# EasyEDA Pro project Servo_tester_Shematic.eprj

# Schematic Schematic1
Create Date: 2022-10-02; Page Name: P1; Project Name: Servo_tester_Shematic; Schematic Name: Schematic1; Update Date: 2024-05-20; Company: EasyEDA.com; Drawed: EasyEDA Pro; Page Size: A4; Part Number: JLCPCB-002; Reviewed: EasyEDA Pro; Version: V0.1
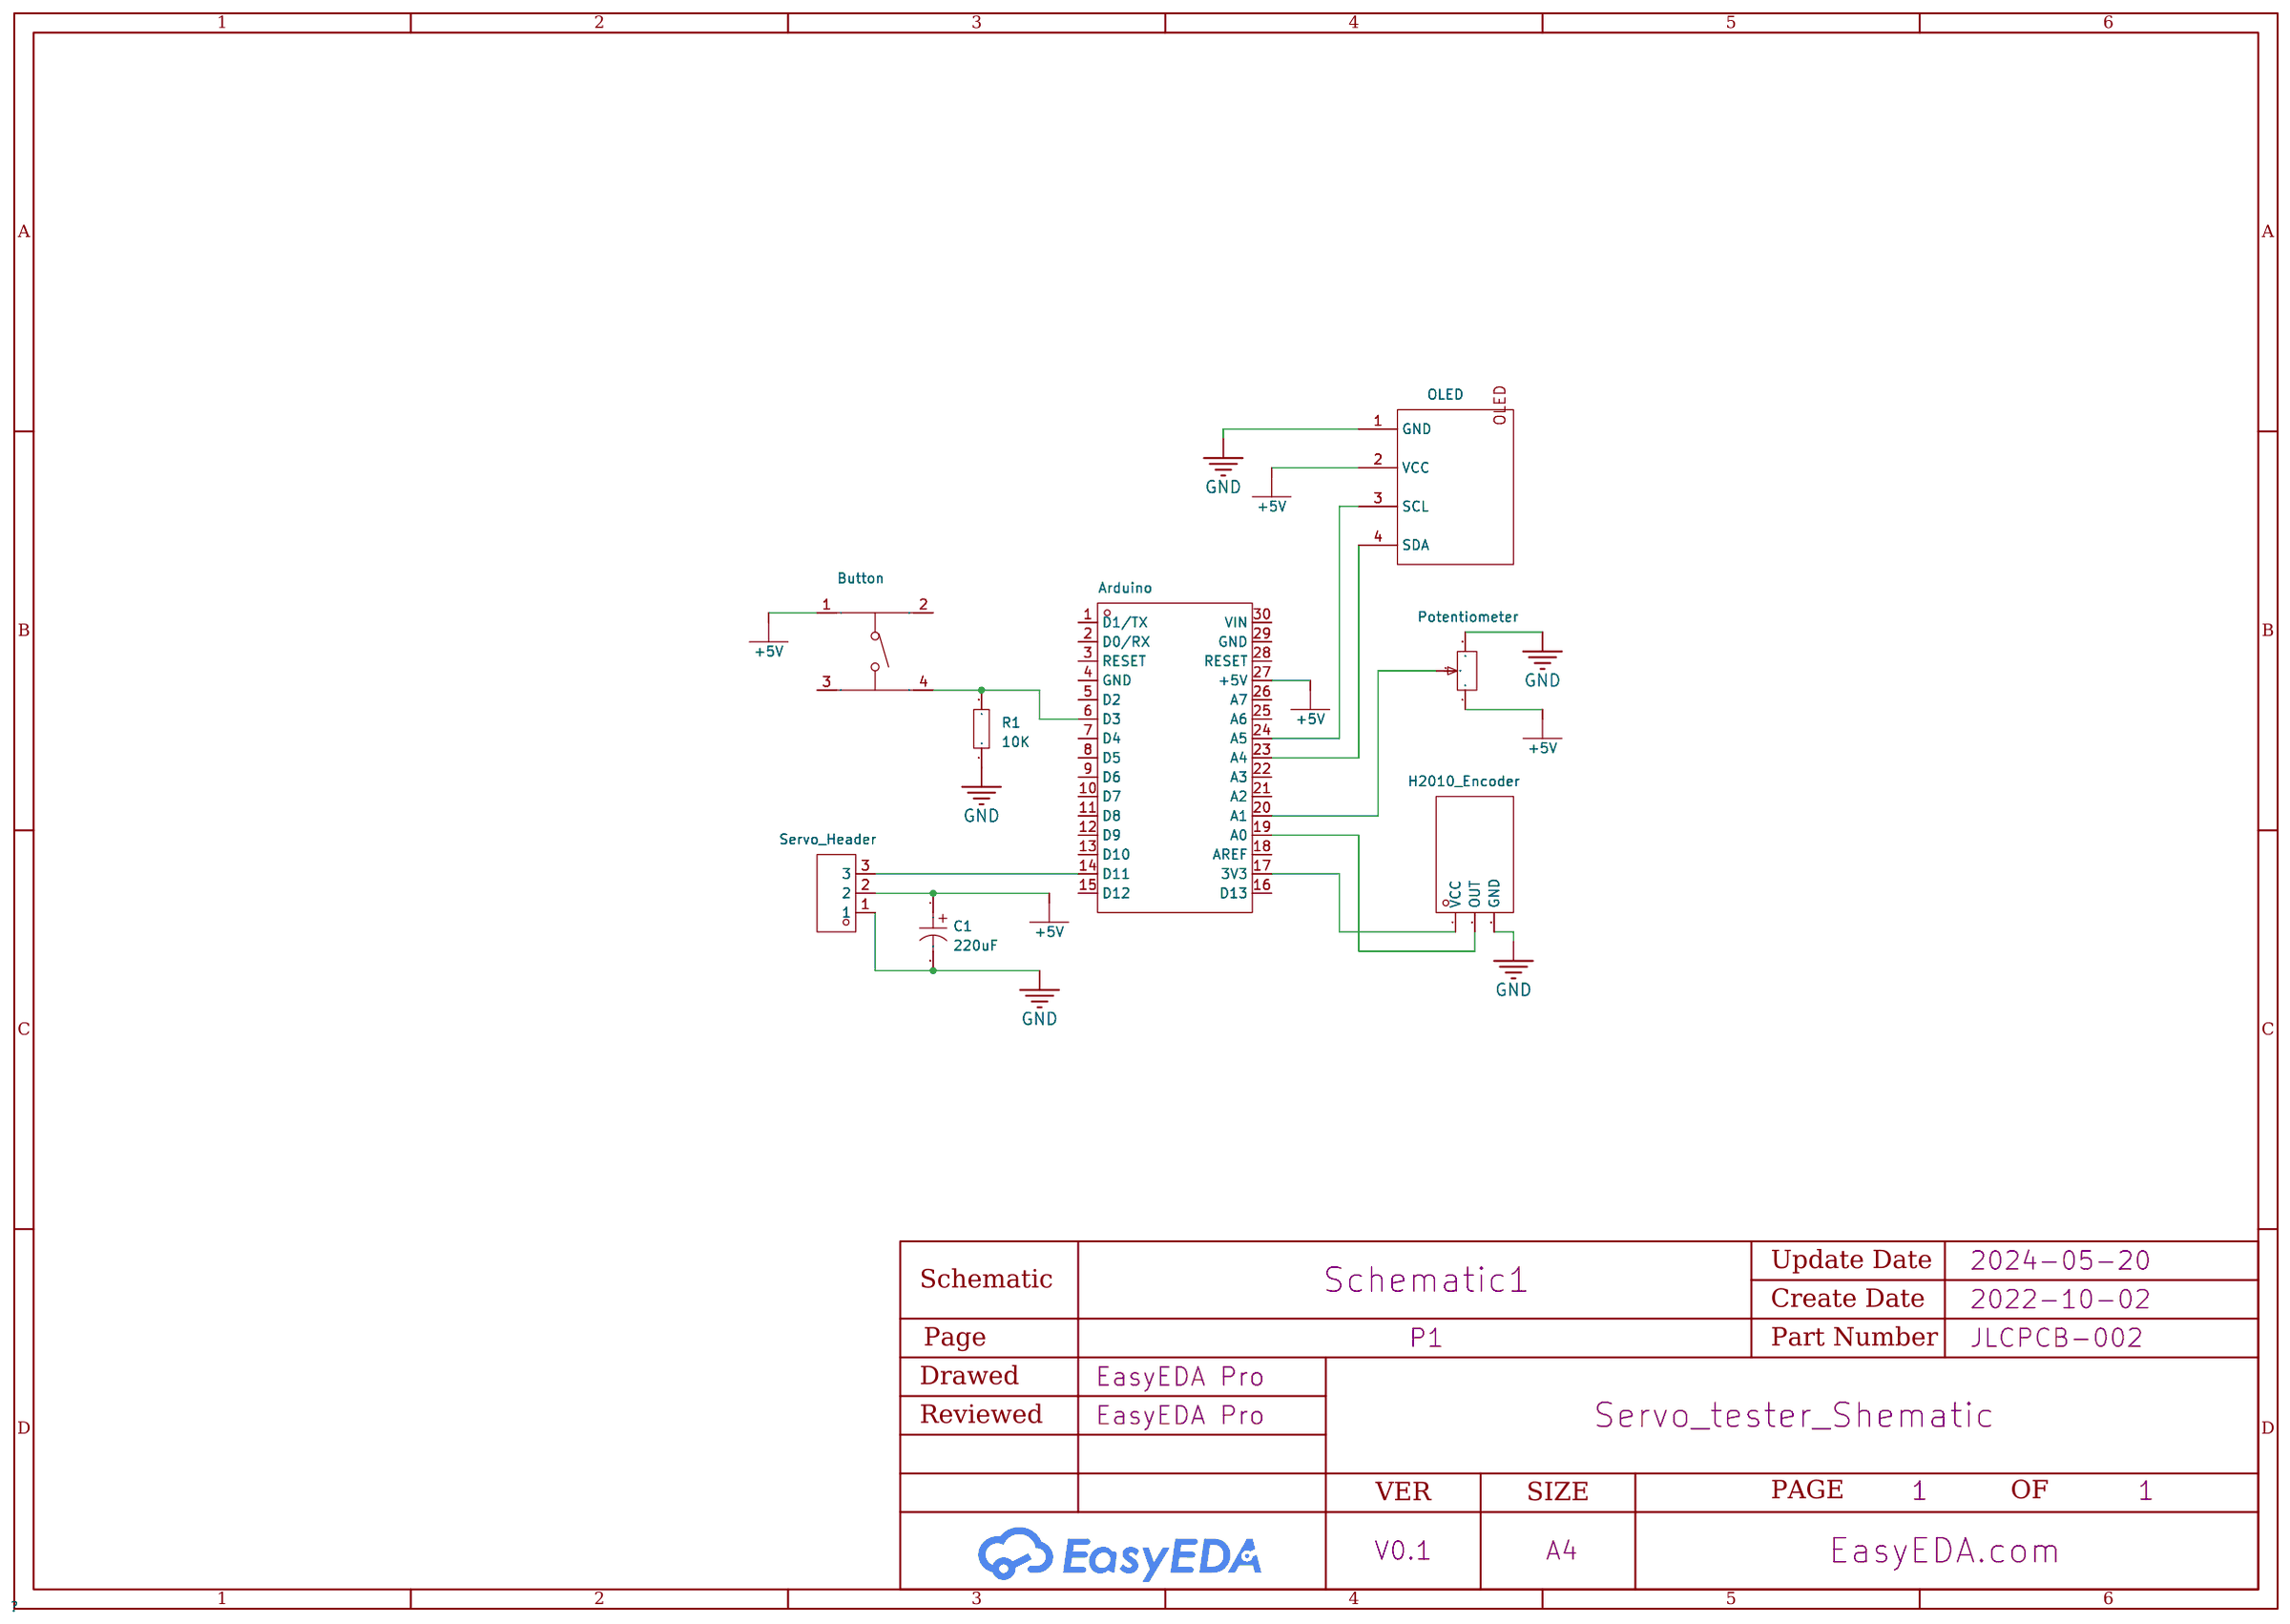
[diagram p0: schematic sheet]

## Parts
Arduino  -  [COMM-TH_ARDUINO_NANO]
C1  220uF  [CAP-TH_BD8.0-P3.50-D0.6-FD-2]
H1  Servo_Header  [HDR-TH_3P-P2.54-V-M]
H2010_Encoder  POWER3-1  [CONN-TH_XH2.54-3P]
KEY1  Button  [KEY-SMD_4P-L6.0-W6.0-P4.50-LS9.0]
OLED1  OLED  [0.96OLED_4P]
R1  10K  [RES-TH_BD2.5-L7.0-P11.00-D0.6-A]
U2  Potentiometer  [RES-ADJ-SMD_VG039NCH]

## Library data of the parts
Arduino = ARDUINO_NANO: Supplier Part: C9900017879; Supplier Footprint: THrough hole; JLCPCB Part Class: Extended Part; Datasheet: https://atta.szlcsc.comnull; Supplier: LCSC
C1 = KNH2220UF35V149EC0049: Capacitance: Tolerance:±20% Tolerance:±20% Rated Voltage: φD: L: Lead Spacing: Ripple Current:1.7A@100kHz Equivalent Series Resistance(ESR):40mΩ@100kHz Lifetime @ Temp:2000hrs@105 Operating Temperature:-55~+105 Operating Temperature:-55~+105; LCSC Part Name: 220uF ±20% 35V; Supplier Part: C2981462; Manufacturer: KNSCHA(科尼盛); Supplier Footprint: 径向引线,8x9mm; JLCPCB Part Class: Extended Part; Datasheet: https://atta.szlcsc.com/upload/public/pdf/source/20220426/9FC8A158D93B909CC105160B4A0CB698.pdf; Supplier: LCSC; Tolerance: ±20%; Ripple Current: 1.7A@100kHz; Equivalent Series Resistance(ESR): 40mΩ@100kHz; Lifetime @ Temp: 2000hrs@105; Operating Temperature: -55~+105
H1 = KH-2.54PH180-1X3P-L11.5: Pitch:2.54mm Number of Pins:3 Number of Rows:1 Pin Structure:1x3P Row Spacing:- Mounting Type:直插 Circluar Pins/Square Pins:方针 Current Rating (Max):3A Voltage Rating (Max):- Length of Mating Pin:6mm Insulation Height:2.5mm Length of End Connection Pin:3mm; LCSC Part Name: 2.54mm 1x3P 直插 方针; Supplier Part: C2932698; Manufacturer: kinghelm(金航标); Supplier Footprint: 插件,P=2.54mm; JLCPCB Part Class: Extended Part; Datasheet: https://atta.szlcsc.com/upload/public/pdf/source/20211220/D2AB060C07EA7DD91A5B4AA994AB98CA.pdf; Supplier: LCSC; Pitch: 2.54mm; Number of Pins: 3; Number of Rows: 1; Pin Structure: 1x3P; Mounting Type: 直插; Circluar Pins/Square Pins: 方针; Current Rating (Max): 3A; Length of Mating Pin: 6mm; Insulation Height: 2.5mm; Length of End Connection Pin: 3mm; Operating Temperature Range: -40~+105; Color: 黑色
H2010_Encoder = POWER3-1: Supplier Part: C9900009168; Supplier Footprint: Header3; JLCPCB Part Class: Extended Part; Supplier: LCSC
KEY1 = BUTTON1: Supplier Part: C9900018962; Supplier Footprint: SMD-4P; JLCPCB Part Class: Extended Part; Datasheet: https://atta.szlcsc.comnull; Supplier: LCSC
OLED1 = 0.96OLED_4P_MODULE_JX: Supplier Part: C9900004566; Supplier Footprint: THrough hole; JLCPCB Part Class: Extended Part; Datasheet: https://atta.szlcsc.comnull; Supplier: LCSC
R1 = 10K: Supplier Part: C9900023230; Supplier Footprint: TH; JLCPCB Part Class: Extended Part; Datasheet: https://atta.szlcsc.comnull; Supplier: LCSC
U2 = 3*3Potentiometer-10kΩ20%: Supplier Part: C9900010776; Supplier Footprint: SMD-3P; JLCPCB Part Class: Extended Part; Datasheet: https://atta.szlcsc.comnull; Supplier: LCSC

## Nets
+5V: Arduino.27(+5V) C1.1 H1.2 KEY1.1 OLED1.2(VCC) U2.1
GND: C1.2 H1.1 H2010_Encoder.3(GND) OLED1.1(GND) R1.1 U2.3
Net-(Arduino-6): Arduino.6(D3) KEY1.4 R1.2
Net-(Arduino-14): Arduino.14(D11) H1.3
Net-(Arduino-17): Arduino.17(3V3) H2010_Encoder.1(VCC)
Net-(Arduino-19): Arduino.19(A0) H2010_Encoder.2(OUT)
Net-(Arduino-20): Arduino.20(A1) U2.2
Net-(Arduino-23): Arduino.23(A4) OLED1.4(SDA)
Net-(Arduino-24): Arduino.24(A5) OLED1.3(SCL)

Not connected (* = marked no-connect by the designer): Arduino 1(D1/TX) 2(D0/RX) 3(RESET) 4(GND) 5(D2) 7(D4) 8(D5) 9(D6) 10(D7) 11(D8) 12(D9) 13(D10) 15(D12) 16(D13) 18(AREF) 21(A2) 22(A3) 25(A6) 26(A7) 28(RESET) 29(GND) 30(VIN); KEY1 2 3
